# EAGLE design TPA3122_Class-D (EAGLE 8.7.1)
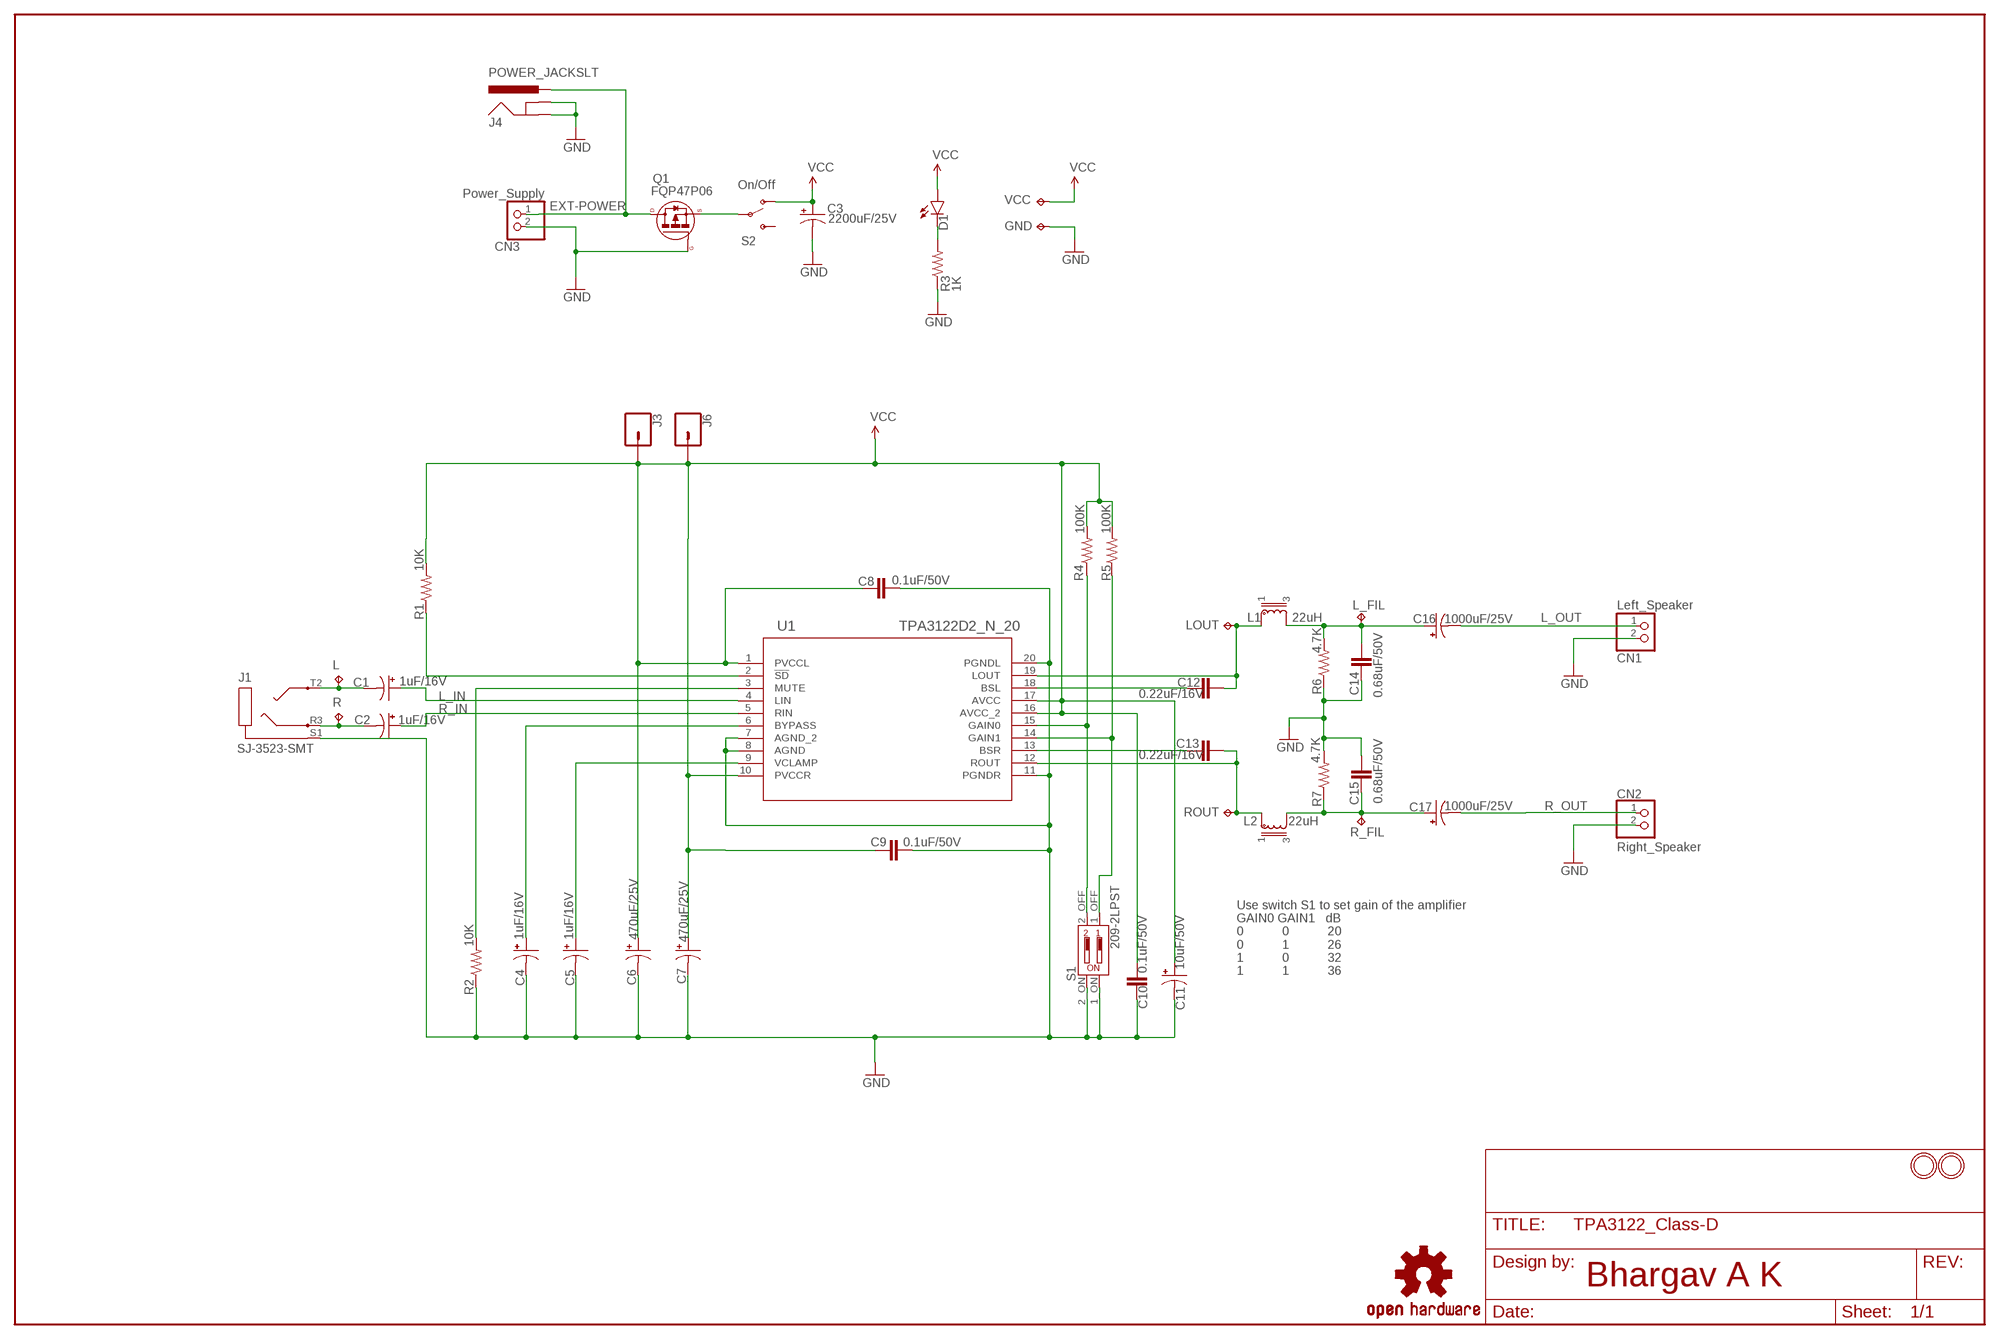
[diagram p0: schematic, sheet 1]

## Parts
C1  1uF/16V  CPOL-USE2.5-5  [E2,5-5]
C2  1uF/16V  CPOL-USE2.5-5  [E2,5-5]
C3  2200uF/25V  CPOL-USE5-13  [E5-13]
C4  1uF/16V  CPOL-USE2.5-5  [E2,5-5]
C5  1uF/16V  CPOL-USE2.5-5  [E2,5-5]
C6  470uF/25V  CPOL-USE5-10.5  [E5-10,5]
C7  470uF/25V  CPOL-USE5-10.5  [E5-10,5]
C8  0.1uF/50V  C-EU050-024X044  [C050-024X044]
C9  0.1uF/50V  C-EU050-024X044  [C050-024X044]
C10  0.1uF/50V  C-EU050-024X044  [C050-024X044]
C11  10uF/50V  CPOL-USE2.5-5  [E2,5-5]
C12  0.22uF/16V  C-EU050-024X044  [C050-024X044]
C13  0.22uF/16V  C-EU050-024X044  [C050-024X044]
C14  0.68uF/50V  C-EU050-024X044  [C050-024X044]
C15  0.68uF/50V  C-EU050-024X044  [C050-024X044]
C16  1000uF/25V  CPOL-USE5-10.5  [E5-10,5]
C17  1000uF/25V  CPOL-USE5-10.5  [E5-10,5]
CN1  Left_Speaker  JST_2PIN-THM  [JST-PH-2-THM]
CN2  Right_Speaker  JST_2PIN-THM  [JST-PH-2-THM]
CN3  Power_Supply  JST_2PIN-THM  [JST-PH-2-THM]
D1  LED3MM  [LED_3MM]
GND  TPB2,54  [B2,54]
J1  SJ-3523-SMT  [SJ-3523-SMT]
J3  CONN_01  [1X01]
J4  POWER_JACKSLT  [POWER_JACK_SLOT]
J6  CONN_01  [1X01]
L  TPB2,54  [B2,54]
L1  22uH  MURATA_1200RS  [MURATA_1200RS]
L2  22uH  MURATA_1200RS  [MURATA_1200RS]
L_FIL  TPB2,54  [B2,54]
LOGO1  OSHW-LOGOM  [OSHW-LOGO-M]
LOUT  TPB2,54  [B2,54]
Q1  FQP47P06  [TO220]
R  TPB2,54  [B2,54]
R1  10K  R-US_0309/10  [0309/10]
R2  10K  R-US_0309/10  [0309/10]
R3  1K  R-US_0309/10  [0309/10]
R4  100K  R-US_0309/10  [0309/10]
R5  100K  R-US_0309/10  [0309/10]
R6  4.7K  R-US_0309/10  [0309/10]
R7  4.7K  R-US_0309/10  [0309/10]
R_FIL  TPB2,54  [B2,54]
ROUT  TPB2,54  [B2,54]
S1  209-2LPST  [209-2LPST]
S2  SWITCH-SPDTPTH  [SWITCH-SPDT]
U1  TPA3122D2_N_20  [N20]
U$2  MOUNTINGHOLE2.5_THICK  [MOUNTINGHOLE_2.5_PLATED_THICK]
U$3  MOUNTINGHOLE2.5_THICK  [MOUNTINGHOLE_2.5_PLATED_THICK]
VCC  TPB2,54  [B2,54]

## Nets
BSL: C12.1 U1.18(BSL)
BSR: C13.1 U1.13(BSR)
BYPASS: C4.+ U1.6(BYPASS)
EXT-POWER: CN3.1(1_VCC) J4.PWR Q1.D
GAIN0: R4.1 S1.2_OFF U1.15(GAIN0)
GAIN1: R5.1 S1.1_OFF U1.14(GAIN1)
GND: C3.- C4.- C5.- C6.- C7.- C8.2 C9.2 C10.2 C11.- C14.2 C15.1 CN1.2(2_GND) CN2.2(2_GND) CN3.2(2_GND) GND.TP J1.S1 J4.GND@1(GNDBREAK) J4.GND@2(GND) Q1.G R2.1 R3.1 R6.1 R7.2 S1.1_ON S1.2_ON U1.7(AGND_2) U1.8(AGND) U1.11(PGNDR) U1.20(PGNDL)
L_FILTERED: C14.1 C16.+ L1.3 L_FIL.TP R6.2
L_IN: C1.+ U1.4(LIN)
L_OUT: C16.- CN1.1(1_VCC)
LED_K: D1.K(C) R3.2
LEFT: C1.- J1.T2 L.TP
LOUT: C12.2 L1.1 LOUT.TP U1.19(LOUT)
MUTE: R2.2 U1.3(MUTE)
PMOS_VOLTAGE_SRC: Q1.S S2.2(P)
R_FILTERED: C15.2 C17.+ L2.3 R7.1 R_FIL.TP
R_IN: C2.+ U1.5(RIN)
R_OUT: C17.- CN2.1(1_VCC)
RIGHT: C2.- J1.R3 R.TP
ROUT: C13.2 L2.1 ROUT.TP U1.12(ROUT)
SD: R1.1 U1.2(!SD)
VCC: C3.+ C6.+ C7.+ C8.1 C9.1 C10.1 C11.+ D1.A J3.1 J6.1 R1.2 R4.2 R5.2 S2.1(O) U1.1(PVCCL) U1.10(PVCCR) U1.16(AVCC_2) U1.17(AVCC) VCC.TP
VCLAMP: C5.+ U1.9(VCLAMP)
Unconnected: S2.3(S)

## Notes on the sheet
- On/Off
- Use switch S1 to set gain of the amplifier
  GAIN0 GAIN1   dB
  0           0           20
  0           1           26
  1           0           32
  1           1           36
- Bhargav A K

## Library data of the parts
C1-C7 C11 C16 C17 = rcl:CPOL-US: POLARIZED CAPACITOR, American symbol
C8-C10 C12-C15 = rcl:C-EU: CAPACITOR, European symbol
CN1-CN3 = TPA3122:JST_2PIN: JST 2-Pin Connectors, Through Hole 2.5mm Pitch
D1 = SparkFun-LED:LED: LED (Generic) Standard schematic elements and footprints for 5mm, 3mm, 1206, and 0603 sized LEDs. Generic LEDs with no color specified.; PROD_ID: DIO-08794
GND L L_FIL LOUT R R_FIL ROUT VCC = tlv:TP: Test pad
J1 = TLV:SJ-3523-SMT: 3.5mm Stereo Jack without Tip Switch from CUI Inc; 3D-MODEL: http://www.cui.com/product/resource/3dmodel/sj-3523-smt; DATASHEET: http://www.cui.com/product/resource/sj-352x-smt-series.pdf; LINK: https://www.arrow.com/en/products/sj-3523-smt-tr/cui-inc; MANUFACTURER: CUI Inc; PACKAGE: SMT, Right Angle Mount; PART_DESC: 3.5MM Stereo Jack, SMD RA; PART_NUMBER: SJ-3523-SMT
J3 J6 = SparkFun-Connectors:CONN_01: Single connection point. Often used as Generic Header-pin footprint for 0.1 inch spaced/style header connections On any of the 0.1 inch spaced packages, you can populate with these: Break Away Headers - Straight <https://www.sparkfun.com/products/116> (PRT-00116) Break Away Male Headers - Right Angle <https://www.sparkfun.com/products/553> (PRT-00553) Female Headers <https://www.sparkfun.com/products/115> (PRT-00115) Break Away Headers - Machine Pin <https://www.sparkfun.com/products/117> (PRT-00117) Break Away Female Headers - Swiss Machine Pin <https://www.sparkfun.com/products/743> (PRT-00743) This device is also useful as a general connection point to wire up your design to another part of your project. Our various solder wires solder well into these plated through hole pads. Hook-Up Wire - Assortment (Stranded, 22 AWG) <https://www.sparkfun.com/products/11375> (PRT-11375) Hook-Up Wire - Assortment (Solid Core, 22 AWG) <https://www.sparkfun.com/products/11367> (PRT-11367) View the entire wire category on our website here <https://www.sparkfun.com/categories/141> Special notes: SMTSO-256-ET is a "flush mount" nut for a 4-40 screw. We mostly use this on specialty testbeds; it is a nice way to connect hardware to your PCB at an adjustable hieght. Also note, the SNAP packages are for using a snappable style connector. We sell a baggie of snaps and they are also used on two LilyPad designs: Snap Assortment - 30 pack (male and female) <https://www.sparkfun.com/products/11347> (DEV-11347) LilyPad Arduino SimpleSnap <https://www.sparkfun.com/products/10941> (DEV-10941) LilyPad SimpleSnap Protoboard <https://www.sparkfun.com/products/10940> (DEV-10940)
J4 = TPA3122:POWER_JACK: Power Jack This is the standard 5.5mm barrel jack for power. The PTH is the most common, proven, reliable, footprint. The Slot footprint only works if the mill layer is transmitted to the PCB fab house so be warned. Spark Fun Electronics SKU : PRT-00119 SMT: CONN-08106 Mating wall wart : TOL-00298 (and others)
L1 L2 = TPA3122:MURATA_1200RS: INDUCTOR; OC_FARNELL: unknown; OC_NEWARK: unknown
LOGO1 = SparkFun-Aesthetics:OSHW-LOGO: Open-Source Hardware (OSHW) Logo This logo indicates the piece of hardware it is found on incorporates a OSHW license and/or adheres to the definition of open source hardware found here: http://freedomdefined.org/OSHW
Q1 = TPA3122:FQP47P06
R1-R7 = rcl:R-US_: RESISTOR, American symbol
S1 = TPA3122:209-2LPST: 2-Position DIP Switch 2-circuit DIP (dual inline package) switch. Commonly used to physcially set a circuit's behavior.
S2 = SparkFun-Electromechanical:SWITCH-SPDT: SPDT Switch Simple slide switch, Spark Fun Electronics SKU : COM-00102 DPDT SMT slide switch, AYZ0202, SWCH-08179
U1 = TPA3122:TPA3122D2_N_20; MANUFACTURER_PART_NUMBER: TPA3122D2_N_20; VENDOR: Texas Instruments
U$2 U$3 = microbuilder:MOUNTINGHOLE: Mounting Hole For #2 screws (0.086"/2.18mm width, 0.094"/2.4mm hole) use 2.5mm

## Board
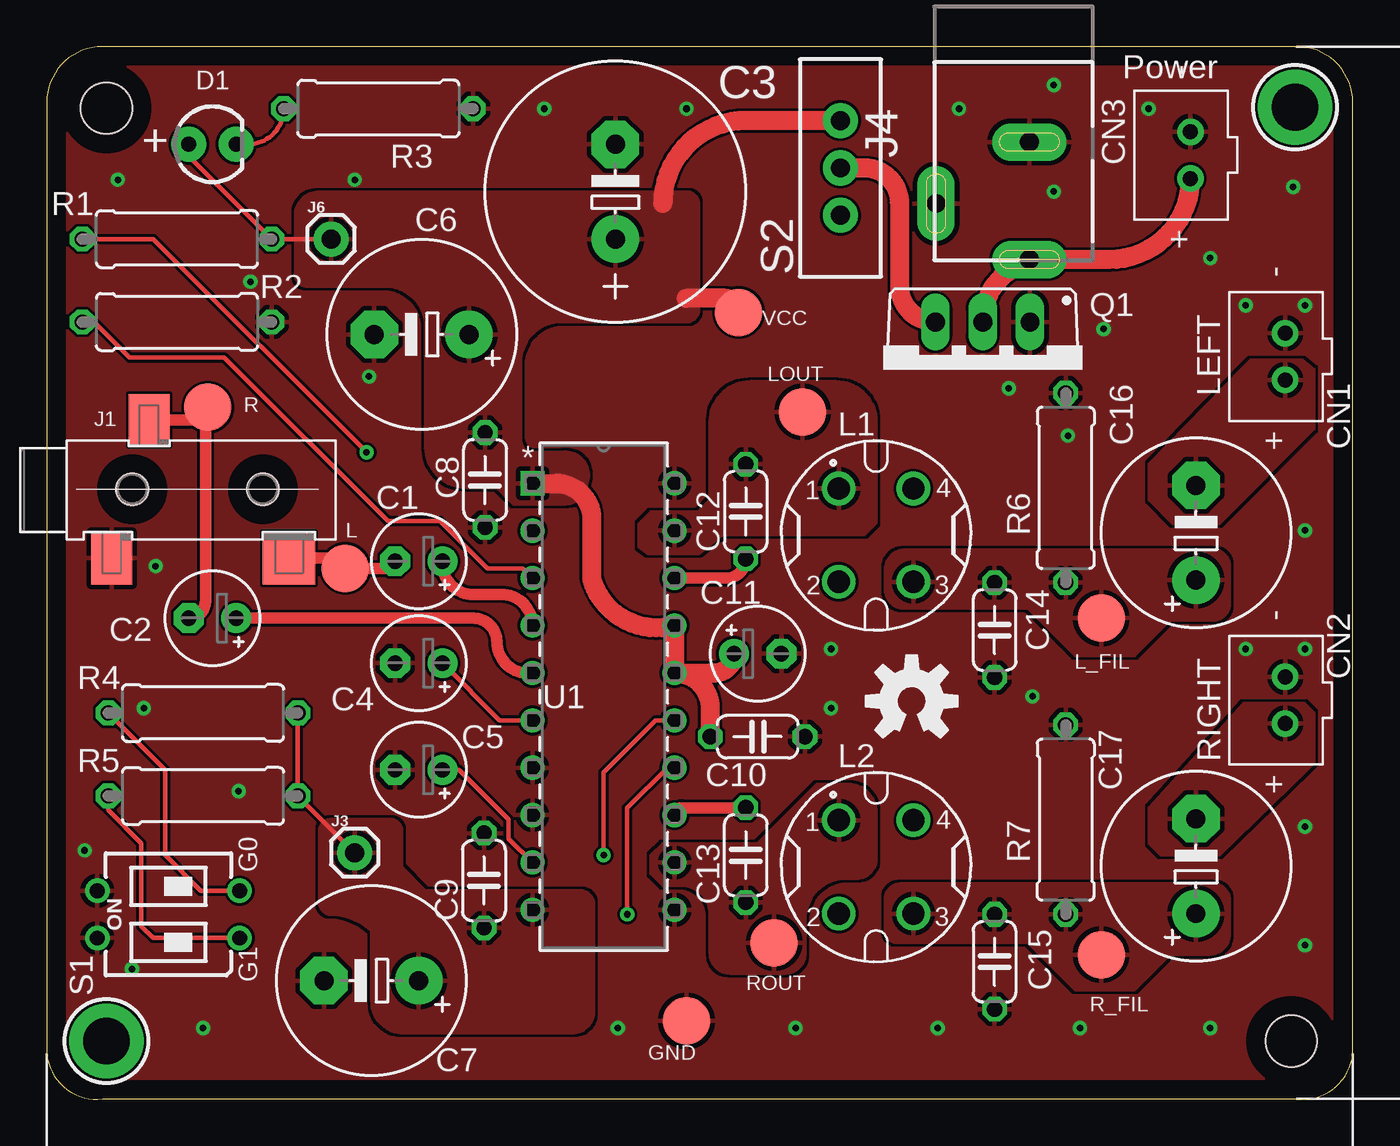
[diagram p1: board, top side]
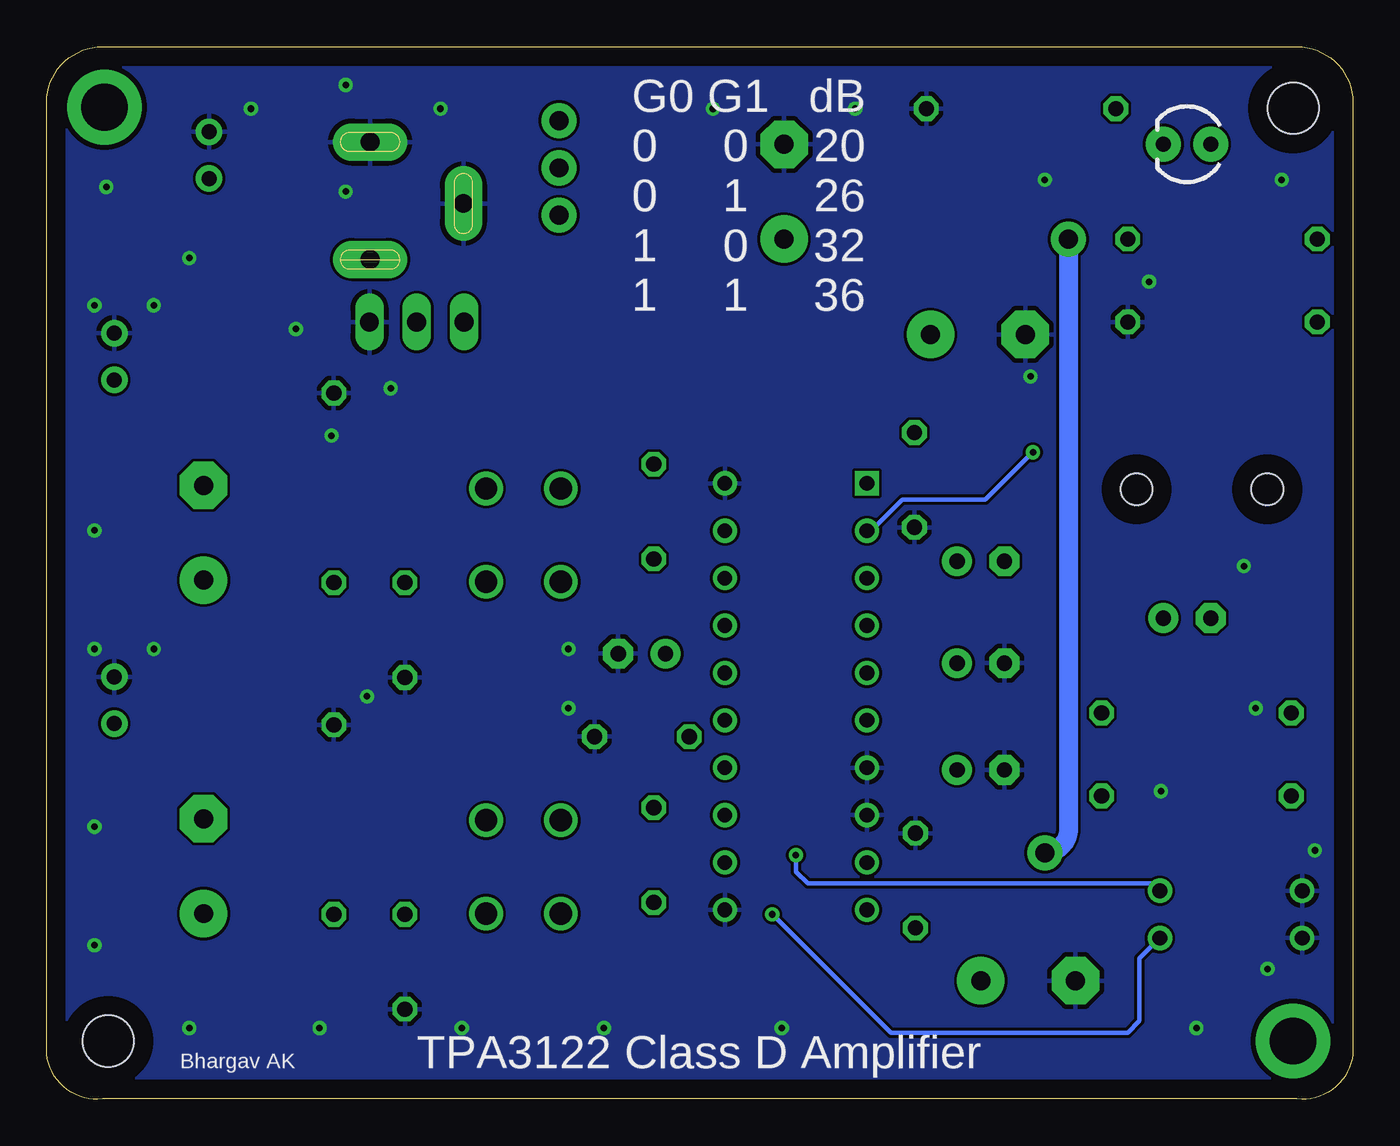
[diagram p2: board, bottom side, seen from below]

Size 70 x 56.42 mm. Coordinates in mm from the lower left corner, seen from the top.
Outline: 0,53.42 0,2.42 arc90 3,0.02 67,0.02 arc90 70,2.42 70,53.42 arc90 67,56.42 3,56.42 arc90 0,53.42
Copper layers (1*16): Top 0.035mm / dielectric 1.5mm / Bottom 0.035mm
Design rules "default": minimum track width 6mil, minimum drill 0.35mm, track to track 6mil, track to pad 6mil, pad to pad 6mil, via to via 6mil, smd to smd 6mil, copper to edge 40mil, drill to drill 6mil, minimum pad ring 10mil, minimum via ring 8mil, stop-mask expansion 4mil, vias tented up to drill 0mil, thermal gap 10mil
Holes 2.75 mm at 3.2,53.12 66.7,3.12
tRestrict: area 2,51.9 to 4.4,54.3; area 65.5,1.9 to 67.9,4.3
bRestrict: area 2,51.9 to 4.4,54.3; area 65.5,1.9 to 67.9,4.3

### Footprints (pad centres in the part's own frame; a part is rotated, then mirrored left to right if it is on the bottom)
E2,5-5 = drill 0.813 pad 1.6: + -1.27,0 | drill 0.813 pad 1.6 octagon: - 1.27,0
E5-13 = drill 1.016 pad 2.54: + -2.54,0 | drill 1.016 pad 2.54 octagon: - 2.54,0
E5-10,5 = drill 1.016 pad 2.54: + -2.54,0 | drill 1.016 pad 2.54 octagon: - 2.54,0
C050-024X044 = drill 0.813 octagon: 1 -2.54,0; 2 2.54,0
JST-PH-2-THM = drill 0.8 pad 1.422: 1 -1.2,0.3; 2 1.3,0.3
LED_3MM = drill 0.813 pad 1.88: A -1.27,0; K 1.27,0
B2,54 = smd 2.54 x 2.54: TP 0,0
SJ-3523-SMT = smd 2.2 x 2.8: R3 -1.5,4.9; S1 -3.5,-2.5 | smd 2.8 x 2.8: T2 6,-2.5 | hole 1.7: 4.6,1.2; -2.4,1.2
1X01 = drill 1.016 pad 1.88: 1 0,0
POWER_JACK_SLOT = drill 1 pad 2 long: GND@1 2.58,7.5; GND@2 7.58,10.8; PWR 2.58,13.8
MURATA_1200RS = drill 1.2: 1 -2,2.5; 2 -2,-2.5; 3 2,-2.5; 4 2,2.5
TO220 = drill 1.016 long: D 0,-2.54; G -2.54,-2.54; S 2.54,-2.54
0309/10 = drill 0.813 octagon: 1 -5.08,0; 2 5.08,0
209-2LPST = drill 0.8: 1_OFF -1.27,-3.81; 1_ON -1.27,3.81; 2_OFF 1.27,-3.81; 2_ON 1.27,3.81
SWITCH-SPDT = drill 1.016 pad 1.88: 1 0,2.54; 2 0,0; 3 0,-2.54
N20 = drill 0.787 pad 1.295 square: 1 -7.62,22.86 | drill 0.787 pad 1.295: 2 -7.62,20.32; 3 -7.62,17.78; 4 -7.62,15.24; 5 -7.62,12.7; 6 -7.62,10.16; 7 -7.62,7.62; 8 -7.62,5.08; 9 -7.62,2.54; 10 -7.62,0; 11 0,0; 12 0,2.54; 13 0,5.08; 14 0,7.62; 15 0,10.16; 16 0,12.7; 17 0,15.24; 18 0,17.78; 19 0,20.32; 20 0,22.86
MOUNTINGHOLE_2.5_PLATED_THICK = drill 2.5 pad 4: P$1 0,0

### Placement (x,y rotation side)
C1  19.94,28.83 180 top
C2  8.89,25.79 180 top
C3  30.48,48.65 90 top
C4  19.94,23.37 180 top
C5  19.94,17.66 180 top
C6  20.09,40.99 180 top
C7  17.4,6.36 180 top
C8  23.49,33.2 270 top
C9  23.44,11.72 90 top
C10  38.1,19.44 0 top
C11  38.1,23.88 0 top
C12  37.47,31.5 90 top
C13  37.47,13.09 270 top
C14  50.8,25.15 270 top
C15  50.8,7.37 90 top
C16  61.59,30.37 90 top
C17  61.59,12.49 90 top
CN1  66.67,39.76 90 top
CN2  66.67,21.34 90 top
CN3  61.59,50.55 90 top
D1  8.89,51.19 0 top
GND  34.29,4.2 0 top
J1  6.99,31.5 0 top
J3  16.51,13.21 0 top
J4  55.24,58.81 180 top
J6  15.24,46.11 0 top
L  16,28.45 0 top
L1  44.45,30.23 0 top
L2  44.45,12.45 0 top
L_FIL  56.52,25.79 0 top
LOGO1  46.35,21.34 0 top
LOUT  40.51,36.84 0 top
Q1  50.16,39.12 180 top
R  8.64,37.09 0 top
R1  6.99,46.11 0 top
R2  6.99,41.66 180 top
R3  17.78,53.09 180 top
R4  8.38,20.71 0 top
R5  8.38,16.26 0 top
R6  54.61,32.77 270 top
R7  54.61,14.99 90 top
R_FIL  56.52,7.75 0 top
ROUT  38.99,8.39 0 top
S1  6.53,9.91 90 top
S2  42.55,49.92 0 top
U1  33.66,10.15 0 top
U$2  3.2,3.12 0 top
U$3  66.91,53.17 0 top
VCC  37.08,42.17 270 top

### Tracks (layer width: path | path; a pad name or v marks a point on that pad's centre or on a via)
BSL
  Top 0.61: U1.18 36.44,27.93 arc90 C12.1
BSR
  Top 0.61: U1.13 arc-90 34.05,15.63 C13.1
BYPASS
  Top 0.254: C4.+ 24.27,20.31 U1.6
EXT-POWER
  Top 0.61: J4.PWR 53.51,45.01
  Top 1.016: Q1.D arc-90 53.51,45.01 | CN3.1 arc-90 56.95,45.01 J4.PWR
GAIN0  (via drill 0.35)
  Top 0.254: R4.1 6.35,17.66 6.35,13.09 8.26,11.18 S1.2_OFF | v29.84,13.09 29.84,17.53 32.62,20.31 U1.15
  Bottom 0.254: S1.2_OFF 10.72,11.56 29.21,11.56 29.84,12.2 v29.84,13.09
GAIN1  (via drill 0.35)
  Top 0.254: S1.1_OFF 5.71,8.64 5.08,9.28 5.08,13.72 3.3,15.5 R5.1 | v31.11,9.91 31.11,15.63 33.26,17.77 U1.14
  Bottom 0.254: S1.1_OFF 11.43,7.55 11.43,4.2 12.06,3.56 24.77,3.56 v31.11,9.91
GND  (via drill 0.35)
  other vias: 3.81,49.28 16.51,49.28 26.67,53.09 34.29,53.09 59.05,53.09 48.9,53.09 53.98,54.36 53.98,48.65 64.26,42.55 66.8,48.9 42.04,24.14 62.36,45.09 56.64,41.28 51.56,38.11 54.74,35.57 17.27,38.74 10.92,43.82 5.84,28.58 5.21,20.96 10.29,16.52 2.03,13.34 4.57,6.99 8.38,3.82 30.61,3.82 40.13,3.82 47.75,3.82 55.37,3.82 62.36,3.82 67.44,8.26 67.44,14.61 67.44,24.14 64.26,24.14 67.44,42.55 67.44,30.49 42.04,20.96 52.83,21.6
  pour Top (rank 5): 70.27,53.63 70.27,2.62 arc-90 67.26,-0.38 2.79,-0.19 arc-90 -0.2,2.81 -0.2,53.82 arc-90 2.81,56.82 67.28,56.63 arc-90
  pour Bottom: 70.27,53.63 70.27,2.62 arc-90 67.26,-0.38 2.79,-0.19 arc-90 -0.2,2.81 -0.2,53.82 arc-90 2.81,56.82 67.28,56.63 arc-90
L_FILTERED
  pour Top: 52.58,26.29 45.97,26.29 arc-90 44.96,27.31 44.96,28.39 arc-90 46.03,29.47 62.51,29.47 arc-90 63.37,28.6 63.37,26.53 arc-90 62.51,25.66 60.2,25.66 58.29,23.75 55.12,23.75
L_IN
  Top 0.61: U1.4 arc90 24.37,27.06 22.86,27.06 arc-90 21.21,28.71 C1.+
L_OUT
  pour Top: 60.33,30.87 62.87,30.87 67.94,35.95 67.94,39.12 67.31,39.63 64.52,39.63 64.14,39.25 59.05,34.04 59.05,32.14
LED_K
  Top 0.254: R3.2 arc-90 10.79,51.19 D1.K
LEFT
  Top 0.61: J1.T2 15.45,29 L.TP 18.29,28.45 C1.-
LOUT
  pour Top: 32.38,31.5 34.92,31.5 35.56,32.14 35.56,36.32 arc-90 37.73,38.49 42.28,38.49 arc-90 44.45,36.32 44.45,30.87 43.81,30.23 36.2,30.23 34.92,29.22 32.26,29.22 31.75,29.6 31.75,30.87
MUTE
  Top 0.254: R2.2 2.54,41.66 4.45,39.76 9.53,39.76 18.29,30.99 21.08,30.99 23.62,28.45 25.51,28.45 U1.3
PMOS_VOLTAGE_SRC
  Top 1.016: Q1.S arc-90 45.72,43.57 45.72,48.01 arc90 43.81,49.92 S2.2
R_FILTERED
  pour Top: 52.58,8.39 45.59,8.39 arc-90 44.96,9.02 44.96,10.74 arc-90 45.78,11.56 62.51,11.56 arc-90 63.37,10.69 63.37,8.83 arc-90 62.3,7.75 60.2,7.75 58.29,5.85 55.12,5.85
R_IN
  Top 0.61: U1.5 arc-98 24.13,24.52 arc90 22.86,25.79 C2.+
R_OUT
  pour Top: 59.69,13.09 62.87,13.09 67.56,17.66 67.94,18.04 67.94,20.71 67.44,21.21 64.14,21.21 59.05,15.63 59.05,13.72
RIGHT
  Top 0.61: J1.R3 7.95,36.4 8.51,36.96 | 8.51,36.96 R.TP | C2.- arc90 8.51,26.68 8.51,36.96
ROUT
  pour Top: 32.38,13.09 33.02,13.72 38.1,13.72 41.27,16.9 42.94,16.9 arc-90 44.45,15.39 44.45,12.89 arc-90 43.38,11.82 42.81,11.82 arc90 40.64,9.65 40.64,7.81 arc-90 39.57,6.74 36.63,6.74 arc-90 35.56,7.81 35.56,9.92 arc90 34.05,11.44 33.02,11.44 32.38,12.07
SD  (via drill 0.35)
  Top 0.254: v17.14,34.68 5.71,46.11 R1.1
  Bottom 0.254: v17.14,34.68 19.68,32.14 24.13,32.14 25.8,30.47 U1.2
VCC
  Top 0.254: J6.1 R1.2 7.62,50.55 D1.A | R4.2 R5.2 J3.1
  Top 1.016: U1.16 U1.17 arc-90 29.21,27.93 29.21,31.11 arc90 27.3,33.01 U1.1 | U1.16 35.8,22.85 arc90 C11.+ | U1.16 arc-90 35.56,20.95 C10.1 | S2.1 37.47,52.46 arc90 33.02,48.01 | VCC.TP arc90 36.32,42.93 34.29,42.93
  Bottom 1.016: J6.1 15.24,14.48 arc90 J3.1
  pour Top: 19.05,12.45 19.05,14.36 arc90 18.41,14.99 15.24,14.99 arc90 14.61,14.36 14.61,10.55 arc90 15.24,9.91 15.25,9.91 arc-45 17.4,9.02 17.4,5.27 arc90 19.11,3.56 28.17,3.56 arc90 29.34,4.72 29.34,10.42 arc90 28.57,11.18 20.32,11.18
  pour Top: 24.13,32.77 22.49,32.77 arc-90 20.32,34.94 20.32,41.4 arc90 18.15,43.57 13.97,43.57 arc-90 13.34,44.2 13.34,47.38 arc-90 14.61,48.65 34.29,48.65 arc-90 34.92,48.01 34.92,42.3 arc-89 34.27,41.65 29.21,41.66 27.57,41.66 arc90 25.4,39.49 25.4,35.31 arc90 26.04,34.68 27.48,34.68 arc-124 28.96,33.03 arc-90 27.69,31.88 25.02,31.88
VCLAMP
  Top 0.254: U1.9 24.77,13.96 24.77,14.99 22.1,17.66 C5.+

### Text on the board
tPlace: Power | LEFT | RIGHT | G0 | G1
bPlace: G0 G1 dB / 0 0 20 / 0 1 26 / 1 0 32 / 1 1 36 | TPA3122 Class D Amplifier | Bhargav AK
tNames: +